# EAGLE design adapter (EAGLE 7.2.0)
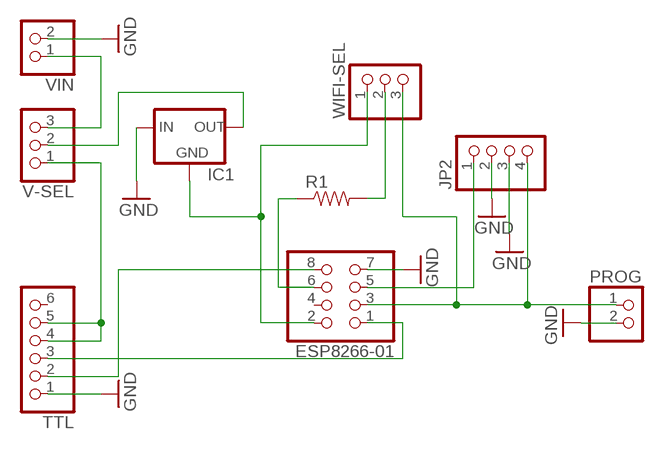
[diagram p0: schematic, sheet 1]

## Parts
ESP8266-01  PINHD-2X4  [2X04]
IC1  V_REG_78XXSIDE  [78XXL]
JP2  PINHD-1X4  [1X04]
PROG  PINHD-1X2  [1X02]
R1  RESISTORAXIAL-0.3  [AXIAL-0.3]
TTL  PINHD-1X6  [1X06]
V-SEL  PINHD-1X3  [1X03]
VIN  PINHD-1X2  [1X02]
WIFI-SEL  PINHD-1X3  [1X03]

## Nets
GND: ESP8266-01.7 IC1.IN JP2.2 JP2.3 PROG.2 TTL.1 VIN.2
N$1: ESP8266-01.2 IC1.GND WIFI-SEL.1
N$2: ESP8266-01.8 TTL.2
N$3: ESP8266-01.1 TTL.3
N$5: TTL.4 TTL.5 V-SEL.1
N$6: ESP8266-01.3 JP2.4 PROG.1 WIFI-SEL.3
N$7: V-SEL.3 VIN.1
N$8: ESP8266-01.6 R1.P$1
N$9: ESP8266-01.5 JP2.1
N$10: R1.P$2 WIFI-SEL.2
N$11: IC1.OUT V-SEL.2
Unconnected: ESP8266-01.4 TTL.6

## Library data of the parts
ESP8266-01 = pinhead:PINHD-2X4: PIN HEADER
IC1 = SparkFun-PowerIC:V_REG_78XX: Voltage Regulator Standard 7805 5V regulator. IGO (Input Ground Output). Spark Fun Electronics SKU : COM-00107
JP2 = pinhead:PINHD-1X4: PIN HEADER
PROG VIN = pinhead:PINHD-1X2: PIN HEADER
R1 = SparkFun-Resistors:RESISTOR: Resistor Basic schematic elements and footprints for 0603, 1206, and PTH resistors.
TTL = pinhead:PINHD-1X6: PIN HEADER
V-SEL WIFI-SEL = pinhead:PINHD-1X3: PIN HEADER

## Board
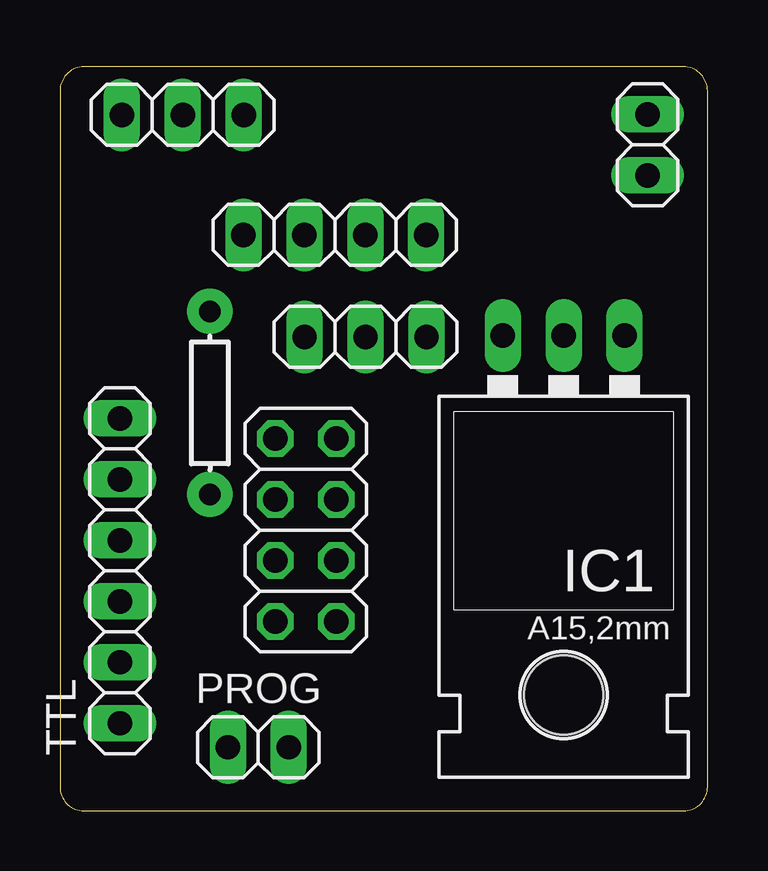
[diagram p1: board, top side]
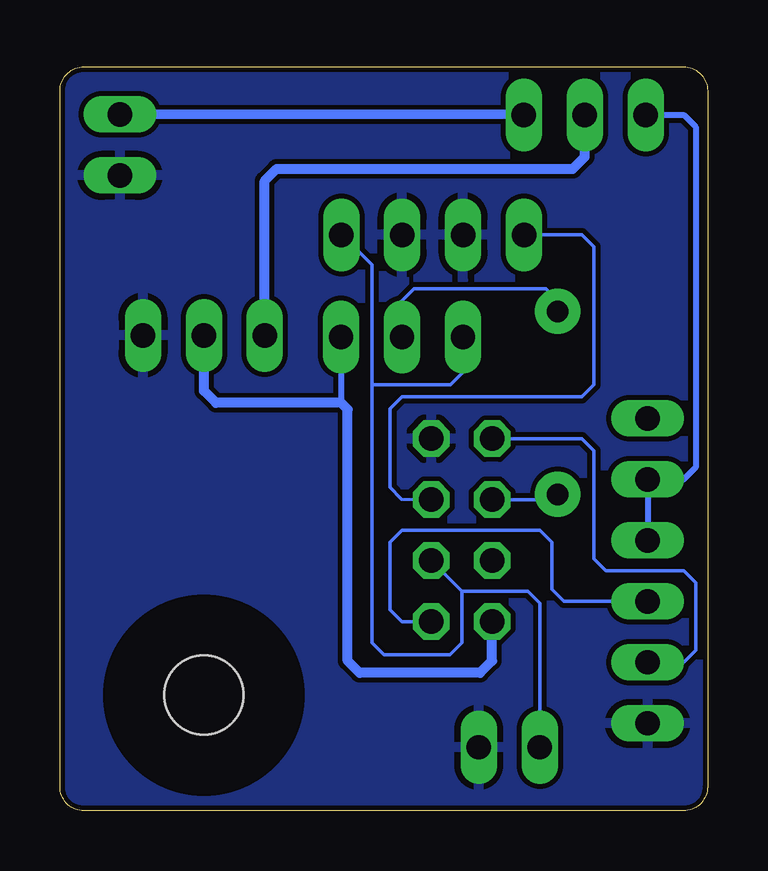
[diagram p2: board, bottom side, seen from below]

Size 27 x 31 mm. Coordinates in mm from the lower left corner, seen from the top.
Outline: 0,30 0,1 arc90 1,0 26,0 arc90 27,1 27,30 arc90 26,31 1,31 arc90 0,30
Copper layers (1*16): Top 0.035mm / dielectric 1.5mm / Bottom 0.035mm
Design rules "default *": minimum track width 10mil, minimum drill 24mil, track to track 8mil, track to pad 8mil, pad to pad 8mil, via to via 8mil, smd to smd 8mil, copper to edge 8mil, drill to drill 8mil, minimum pad ring 10mil, minimum via ring 8mil, stop-mask expansion 4mil, vias tented up to drill 0mil, thermal gap 10mil

### Footprints (pad centres in the part's own frame; a part is rotated, then mirrored left to right if it is on the bottom)
2X04 = drill 1.016 octagon: 1 -3.81,-1.27; 2 -3.81,1.27; 3 -1.27,-1.27; 4 -1.27,1.27; 5 1.27,-1.27; 6 1.27,1.27; 7 3.81,-1.27; 8 3.81,1.27
78XXL = drill 1.016 long: GND 0,-3.81; IN -2.54,-3.81; OUT 2.54,-3.81 | hole 3.302: 0,11.176
1X04 = drill 1.016 long: 1 -3.81,0; 2 -1.27,0; 3 1.27,0; 4 3.81,0
1X02 = drill 1.016 long: 1 -1.27,0; 2 1.27,0
AXIAL-0.3 = drill 0.9 pad 1.88: P$1 -3.81,0; P$2 3.81,0
1X06 = drill 1.016 long: 1 -6.35,0; 2 -3.81,0; 3 -1.27,0; 4 1.27,0; 5 3.81,0; 6 6.35,0
1X03 = drill 1.016 long: 1 -2.54,0; 2 0,0; 3 2.54,0

### Placement (x,y rotation side)
ESP8266-01  10.25,11.7 90 top
IC1  21,16 180 top
JP2  11.46,24 0 top
PROG  8.27,2.65 0 top
R1  6.25,17 90 top
TTL  2.5,10 90 top
V-SEL  5.12,29 0 top
VIN  24.5,27.75 270 top
WIFI-SEL  12.74,19.75 180 top

### Tracks (layer width: path | path; a pad name or v marks a point on that pad's centre or on a via)
GND
  pour Bottom: -1,-1 -0.81,32.31 28,32.31 28,-1
N$1
  Bottom 0.254: WIFI-SEL.1 15.28,17
  Bottom 0.406: ESP8266-01.2 8.98,6.25 9.48,5.75 14.51,5.75 15.01,6.25 15.01,16.73 15.28,17 20.5,17 21,17.5 IC1.GND
N$2
  Bottom 0.15: ESP8266-01.8 5.25,15.51 4.75,15.01 4.75,10.5 4.25,10 1,10 0.5,9.5 0.5,6.69 1,6.19 TTL.2
N$3
  Bottom 0.15: TTL.3 6,8.73 6.5,9.23 6.5,11.2 7,11.7 12.75,11.7 13.25,11.2 13.25,8.39 12.75,7.89 ESP8266-01.1
N$5
  Bottom 0.254: V-SEL.1 1,29 0.5,28.5 0.5,14.31 1,13.81 TTL.5 TTL.4
N$6
  Bottom 0.15: ESP8266-01.3 10.25,9.16 | 10.25,9.16 10.25,7 10.75,6.5 13.5,6.5 14,7 14,17.75 | 14,17.75 10.74,17.75 10.72,17.75 10.24,18.24 WIFI-SEL.3 | JP2.4 14,22.75 14,17.75 | PROG.1 7,8.66 7.5,9.16 10.25,9.16
N$7
  Bottom 0.406: V-SEL.3 VIN.1
N$8
  Bottom 0.15: R1.P$1 6.25,12.97 ESP8266-01.6
N$9
  Bottom 0.15: ESP8266-01.5 12.76,12.99 13.25,13.49 13.25,16.75 12.75,17.25 5.25,17.25 4.75,17.75 4.75,23.5 5.25,24 JP2.1
N$10
  Bottom 0.15: R1.P$2 6.25,21.25 6.75,21.75 12.24,21.75 12.74,21.25 WIFI-SEL.2
N$11
  Bottom 0.406: IC1.OUT 18.46,26.25 17.96,26.75 5.62,26.75 5.12,27.25 V-SEL.2